# Altium schematic sheet TT1-1-Top.SchDoc: Top
size A3; SheetNumber: 1; SheetTotal: 1
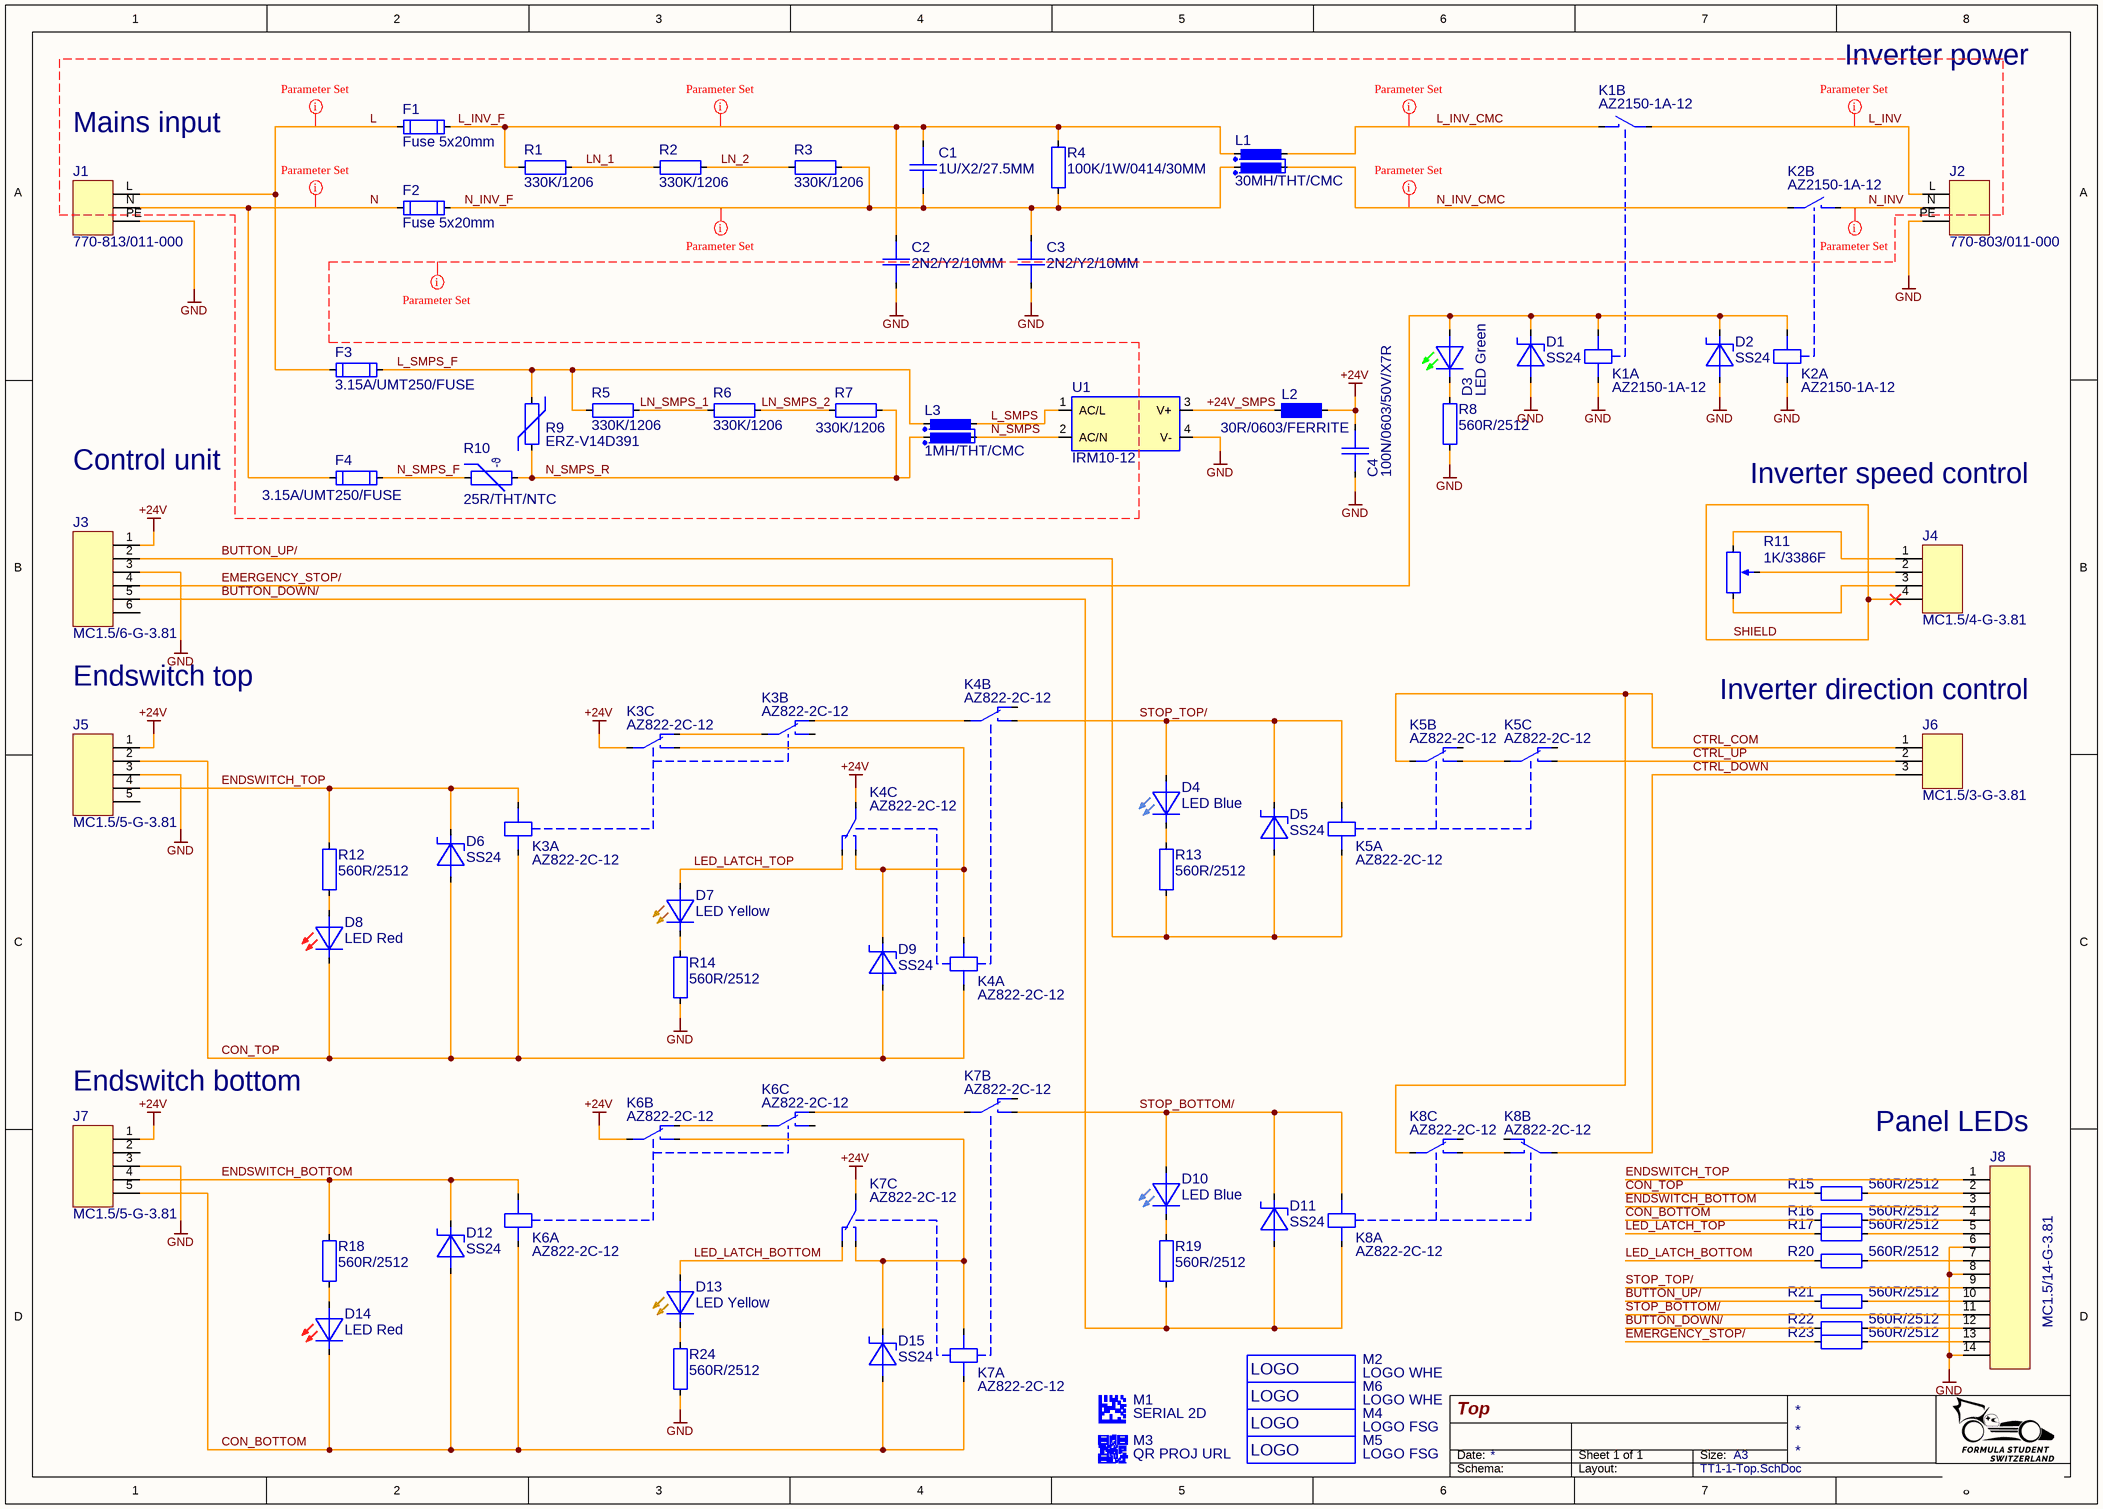
[diagram p0: TT1-1-Top.SchDoc]

## Parts
C1  1U/X2/27.5MM  [CAP2750P315X110X190-BL]
C2  2N2/Y2/10MM  [CAP1000P130X40X90-BL]
C3  2N2/Y2/10MM  [CAP1000P130X40X90-BL]
C4  100N/0603/50V/X7R  [CAP0603_X7R]
D1  SS24  [DIOM5226X230]
D2  SS24  [DIOM5226X230]
D3  LED Green  [LED0603_GREEN]
D4  LED Blue  [LED0603_BLUE]
D5  SS24  [DIOM5226X230]
D6  SS24  [DIOM5226X230]
D7  LED Yellow  [LED0603_YELLOW]
D8  LED Red  [LED0603_RED]
D9  SS24  [DIOM5226X230]
D10  LED Blue  [LED0603_BLUE]
D11  SS24  [DIOM5226X230]
D12  SS24  [DIOM5226X230]
D13  LED Yellow  [LED0603_YELLOW]
D14  LED Red  [LED0603_RED]
D15  SS24  [DIOM5226X230]
F1  Fuse 5x20mm  [OGN_THR]
F2  Fuse 5x20mm  [OGN_THR]
F3  3.15A/UMT250/FUSE  [UMT250]
F4  3.15A/UMT250/FUSE  [UMT250]
J1  770-813/011-000  [770-813/011-000]
J2  770-803/011-000  [770-803/011-000]
J3  MC1.5/6-G-3.81  [MC1.5/6-G-3.81]
J4  MC1.5/4-G-3.81  [MC1.5/4-G-3.81]
J5  MC1.5/5-G-3.81  [MC1.5/5-G-3.81]
J6  MC1.5/3-G-3.81  [MC1.5/3-G-3.81]
J7  MC1.5/5-G-3.81  [MC1.5/5-G-3.81]
J8  MC1.5/14-G-3.81  [MC1.5/14-G-3.81]
K1  AZ2150-1A-12  [AZ2150-SPST-NO]  (parts A,B of 2)
K2  AZ2150-1A-12  [AZ2150-SPST-NO]  (parts A,B of 2)
K3  AZ822-2C-12  [AZ822]  (parts A,B,C of 3)
K4  AZ822-2C-12  [AZ822]  (parts A,B,C of 3)
K5  AZ822-2C-12  [AZ822]  (parts A,B,C of 3)
K6  AZ822-2C-12  [AZ822]  (parts A,B,C of 3)
K7  AZ822-2C-12  [AZ822]  (parts A,B,C of 3)
K8  AZ822-2C-12  [AZ822]  (parts A,B,C of 3)
L1  30MH/THT/CMC  [CMC-WE-CMBNC-XL-7448050530]
L2  30R/0603/FERRITE  [FB0603]
L3  1MH/THT/CMC  [DFKH-CASE-50-2]
M1  SERIAL 2D  [SERIAL-2D-8MM-RESTRICT]  (no BOM)
M2  LOGO WHE  [LOGO-WHE-10MM]  (no BOM)
M3  QR PROJ URL  [QR-PROJECT-URL-10MM]  (no BOM)
M4  LOGO FSG  [LOGO-FSG-15MM]  (no BOM)
M5  LOGO FSG  [LOGO-FSG-20MM]  (no BOM)
M6  LOGO WHE  [LOGO-WHE-20MM]
R1  330K/1206  [R1206-0.80-WW]
R2  330K/1206  [R1206-0.80-WW]
R3  330K/1206  [R1206-0.80-WW]
R4  100K/1W/0414/30MM  [RESAD3000W80L1200D400B]
R5  330K/1206  [R1206-0.80-WW]
R6  330K/1206  [R1206-0.80-WW]
R7  330K/1206  [R1206-0.80-WW]
R8  560R/2512  [R2512-0.65-WW]
R9  ERZ-V14D391  [RESD750W80D155]
R10  25R/THT/NTC  [RESD500W60D115]
R11  1K/3386F  [3386F]
R12  560R/2512  [R2512-0.65-WW]
R13  560R/2512  [R2512-0.65-WW]
R14  560R/2512  [R2512-0.65-WW]
R15  560R/2512  [R2512-0.65-WW]
R16  560R/2512  [R2512-0.65-WW]
R17  560R/2512  [R2512-0.65-WW]
R18  560R/2512  [R2512-0.65-WW]
R19  560R/2512  [R2512-0.65-WW]
R20  560R/2512  [R2512-0.65-WW]
R21  560R/2512  [R2512-0.65-WW]
R22  560R/2512  [R2512-0.65-WW]
R23  560R/2512  [R2512-0.65-WW]
R24  560R/2512  [R2512-0.65-WW]
U1  IRM10-12  [IRM10]

## Nets
+24V: C4.1 J3.1 J5.1 J7.1 K3.6(COM2) K4.6(COM2) K6.3(COM1) K7.6(COM2) L2.2
GND: C2.2 C3.2 C4.2 D1.2 D2.2 J1.PE J2.PE J3.3 J5.3 J7.3 J8.6 J8.8 J8.14 K1.2 K2.2 R8.2 R14.2 R24.2 U1.4(V-)
+24V_SMPS: L2.1 U1.3(V+)
BUTTON_DOWN/: D11.2 J3.5 K8.2 R19.2 R22.1
BUTTON_UP/: D5.2 J3.2 K5.1 R13.2 R21.1
CON_BOTTOM: D12.2 D14.1 D15.2 J7.5 K6.2 K7.2 R16.1
CON_TOP: D6.2 D8.1 D9.2 J5.2 K3.2 K4.2 R15.1
CTRL_COM: J6.1 K5.3(COM1) K8.6(COM2)
CTRL_DOWN: J6.3 K8.3(COM1)
CTRL_UP: J6.2 K5.8(NO2)
EMERGENCY_STOP/: D1.1 D2.1 D3.2 J3.4 K1.1 K2.1 R23.1
ENDSWITCH_BOTTOM: D12.1 J7.4 J8.3 K6.1 R18.1
ENDSWITCH_TOP: D6.1 J5.4 J8.1 K3.1 R12.1
L: F1.1 F3.1 J1.L
L_INV: J2.L K1.3(COM1)
L_INV_CMC: K1.4(NO1) L1.3
L_INV_F: C1.1 C2.1 F1.2 L1.1 R1.1 R4.1
L_SMPS: L3.3 U1.1(AC/L)
L_SMPS_F: F3.2 L3.1 R5.1 R9.1
LED_LATCH_BOTTOM: D13.2 K7.7(NC2) R20.1
LED_LATCH_TOP: D7.2 K4.7(NC2) R17.1
LN_1: R1.2 R2.1
LN_2: R2.2 R3.1
LN_SMPS_1: R5.2 R6.2
LN_SMPS_2: R6.1 R7.1
N: F2.1 F4.1 J1.N
N_INV: J2.N K2.4(NO1)
N_INV_CMC: K2.3(COM1) L1.4
N_INV_F: C1.2 C3.1 F2.2 L1.2 R3.2 R4.2
N_SMPS: L3.4 U1.2(AC/N)
N_SMPS_F: F4.2 R10.1
N_SMPS_R: L3.2 R7.2 R9.2 R10.2
SHIELD: J4.4
STOP_BOTTOM/: D10.2 D11.1 J8.11 K7.5(NO1) K8.1
STOP_TOP/: D4.2 D5.1 J8.9 K4.5(NO1) K5.2
NetD3_1: D3.1 R8.1
NetD4_1: D4.1 R13.1
NetD7_1: D7.1 R14.1
NetD8_2: D8.2 R12.2
NetD9_1: D9.1 K3.8(NO2) K4.1 K4.8(NO2)
NetD10_1: D10.1 R19.1
NetD13_1: D13.1 R24.1
NetD14_2: D14.2 R18.2
NetD15_1: D15.1 K6.5(NO1) K7.1 K7.8(NO2)
NetJ4_1: J4.1 R11.2
NetJ4_2: J4.2 R11.3
NetJ4_3: J4.3 R11.1
NetJ8_2: J8.2 R15.2
NetJ8_4: J8.4 R16.2
NetJ8_5: J8.5 R17.2
NetJ8_7: J8.7 R20.2
NetJ8_10: J8.10 R21.2
NetJ8_12: J8.12 R22.2
NetJ8_13: J8.13 R23.2
NetK3_3: K3.3(COM1) K3.7(NC2)
NetK3_4: K3.4(NC1) K4.3(COM1)
NetK5_5: K5.5(NO1) K5.6(COM2)
NetK6_4: K6.4(NC1) K6.6(COM2)
NetK6_7: K6.7(NC2) K7.3(COM1)
NetK8_5: K8.5(NO1) K8.8(NO2)

Not connected (* = marked no-connect by the designer): J3 6; J5 5; J7 2; K3 5(NO1); K4 4(NC1); K5 4(NC1) 7(NC2); K6 8(NO2); K7 4(NC1); K8 4(NC1) 7(NC2)

## Layout directives
net class Mains: L, L_INV, L_INV_CMC, L_INV_F, L_SMPS, L_SMPS_F, LN_1, LN_2, LN_SMPS_1, LN_SMPS_2, N, N_INV, N_INV_CMC, N_INV_F, N_SMPS, N_SMPS_F, N_SMPS_R
net class L: L, L_INV, L_INV_CMC, L_INV_F
net class N: N, N_INV, N_INV_CMC, N_INV_F

## Notes on the sheet
- Inverter power
- Mains input
- Control unit
- Inverter speed control
- Endswitch top
- (near J6) Inverter direction control
- (near J7) Endswitch bottom
- Panel LEDs
- Date:
- Size:
- A3
- Schema:
- Layout:
- (in symbol 25R/THT/NTC) -ϑ

## Library data of the parts
C1 = 1U/X2/27.5MM: CAP THT 31.5X11X19 1uF 305V X2; Manufacturer: GENERIC; Manufacturer 1: EPCOS - TDK Electronics; Manufacturer Part Number 1: B32924C3105K000; Absolute Value: 1E-6; Part Number: 1U/X2/27.5MM; Value: 1UF; HelpURL: https://product.tdk.com/en/system/files?file=dam/doc/product/capacitor/film/emi/data_sheet/20/20/db/fc_2009/x2_b32921_928.pdf; Supplier 1: Digi-Key; Supplier Part Number 1: 495-4209-ND
C2 C3 = 2N2/Y2/10MM: CAP THT 13X4X9 2.2nF 300V Y2; Manufacturer: GENERIC; Manufacturer 1: EPCOS - TDK Electronics; Manufacturer Part Number 1: B32021A3222K000; Absolute Value: 2.2E-9; Part Number: 2N2/Y2/10MM; Value: 2.2nF; HelpURL: https://www.tdk-electronics.tdk.com/inf/20/20/db/fc_2009/Y2_B32021_026.pdf; Supplier 1: Digi-Key; Supplier Part Number 1: 495-4788-ND
C4 = 100N/0603/50V/X7R: CAP SM 0603 100nF 50V X7R; Manufacturer: GENERIC; Manufacturer 1: YAGEO; Manufacturer Part Number 1: CC0603KPX7R9BB104; Absolute Value: 1E-7; Eurocircuits GPN: GPC0603104; Part Number: 100N/0603/50V/X7R; Package: 0603; Value: 100nF; HelpURL: https://www.yageo.com/upload/media/product/app/datasheet/mlcc/upy-gphc_x7r_6_3v-to-250v.pdf; Supplier 1: Digi-Key; Supplier Part Number 1: 311-3567-1-ND; Manufacturer 2: YAGEO; Manufacturer Part Number 2: CC0603MRX7R9BB104; Supplier 2: Digi-Key; Supplier Part Number 2: 311-4110-1-ND; Supplier 3: LCSC; Supplier Part Number 3: C14663; JLC Type: Basic
D1 D2 D5 D6 D9 D11 D12 D15 = SS24: Si Shottky Diode 2A DO-214AC; Manufacturer: MSKSEMI; Manufacturer 1: Taiwan Semiconductor Corporation; Absolute Value: 40V; Part Number: SS24; Package: DO-214AC, SMA; Value: SS24; HelpURL: https://datasheet.lcsc.com/lcsc/2202131930_MSKSEMI-SS24-MS_C2836395.pdf; Manufacturer Part Number 1: SS24; Supplier 1: Digikey; Supplier Part Number 1: 1801-SS24CT-ND; Manufacturer 3: MSKSEMI; Manufacturer Part Number 3: SS24-MS; Supplier 3: LCSC; Supplier Part Number 3: C2836395; JLC Type: Extended; Manufacturer 2: ElecSuper; Manufacturer Part Number 2: SS24; Supplier 2: LCSC; Supplier Part Number 2: C7509566
D3 = LED Green 0603: Generic LED Green 0603; Manufacturer 1: Würth; Manufacturer Part Number 1: 150060VS75000; Part Number: LED Green 0603; Manufacturer: GENERIC; Package: 603; Value: Green; Absolute Value: Green; HelpURL: https://www.we-online.com/katalog/datasheet/150060VS75000.pdf; Supplier 1: Digikey; Supplier Part Number 1: 732-4980-1-ND; Manufacturer 3: Everlight Elec; Manufacturer Part Number 3: 19-217/GHC-YR1S2/3T; Supplier 3: LCSC; Supplier Part Number 3: C72043; JLC Type: Basic
D4 D10 = LED Blue 0603: Generic LED Blue 0603; Manufacturer 1: Würth; Manufacturer Part Number 1: 150060BS75000; Part Number: LED Blue 0603; Manufacturer: GENERIC; Package: 603; Value: Blue; Absolute Value: Blue; HelpURL: https://www.we-online.com/katalog/datasheet/150060BS75000.pdf; Supplier 1: Digikey; Supplier Part Number 1: 732-4966-1-ND; Manufacturer 3: Everlight Elec; Manufacturer Part Number 3: 19-217/BHC-ZL1M2RY/3T; Supplier 3: LCSC; Supplier Part Number 3: C72041; JLC Type: Basic
D7 D13 = LED Yellow 0603: Generic LED Yellow 0603; Manufacturer 1: Würth; Manufacturer Part Number 1: 150060YS75000; Part Number: LED Yellow 0603; Manufacturer: GENERIC; Package: 603; Value: Yellow; Absolute Value: Yellow; HelpURL: https://www.we-online.com/components/products/datasheet/150060YS75000.pdf; Supplier 1: Digikey; Supplier Part Number 1: 732-4981-1-ND; Manufacturer 3: Everlight Elec; Manufacturer Part Number 3: 19-213/Y2C-CQ2R2L/3T(CY); Supplier 3: LCSC; Supplier Part Number 3: C72038; JLC Type: Basic
D8 D14 = LED Red 0603: Generic LED Red 0603; Manufacturer 1: Würth; Manufacturer Part Number 1: 150060RS75000; Part Number: LED Red 0603; Manufacturer: GENERIC; Package: 603; Value: Red; Absolute Value: Red; HelpURL: https://www.we-online.com/katalog/datasheet/150060RS75000.pdf; Supplier 1: Digikey; Supplier Part Number 1: 732-4978-1-ND; Manufacturer 3: Hubei KENTO Elec; Manufacturer Part Number 3: KT-0603R; Supplier 3: LCSC; Supplier Part Number 3: C2286; JLC Type: Basic
F1 F2 = Fuse/5x20mm/OGN: open fuse holder, 5 x 20 mm, THR, IEC 60335-1; Manufacturer: Schurter; Manufacturer Part Number 1: 3-132-873; Part Number: Fuse/5x20mm/OGN; Package: 5X20; HelpURL: https://www.schurter.com/en/datasheet/typ_OGN.pdf; Manufacturer 1: Schurter; Supplier 1: Digi-Key; Supplier Part Number 1: 486-3-132-873-ND
F3 F4 = 3.15A/UMT250/FUSE: Fuse 250VAC 3.15A UMT250; Manufacturer: Schurter; Manufacturer Part Number 1: 3403.0171.24; Absolute Value: 3.15; Part Number: 3.15A/UMT250/FUSE; Package: UMT250; HelpURL: https://www.schurter.com/en/datasheet/typ_UMT_250.pdf; Manufacturer 1: Schurter; Supplier 1: Digi-Key; Supplier Part Number 1: 486-3482-1-ND; Value: 3.15A
J1 = 770-813/011-000: Wago 770-813/011-000; Manufacturer 1: WAGO Corporation; Part Number: 770-813/011-000; Manufacturer: Wago; HelpURL: https://www.wago.com/global/pluggable-connectors/plug-for-pcbs/p/770-813_011-000; Manufacturer Part Number 1: 770-813/011-000; Supplier 1: Digi-Key; Supplier Part Number 1: 2946-770-813/011-000-ND
J2 = 770-803/011-000: Wago 770-803/011-000; Manufacturer 1: WAGO Corporation; Part Number: 770-803/011-000; Manufacturer: Wago; HelpURL: https://www.wago.com/global/pluggable-connectors/socket-for-pcbs/p/770-803_011-000; Manufacturer Part Number 1: 770-803/011-000; Supplier 1: Digi-Key; Supplier Part Number 1: 2946-770-803/011-000-ND
J3 = MC1.5/6-G-3.81: Phoenix contact MC 1,5/ 6-G-3,81; Manufacturer Part Number 1: 1803316; Part Number: MC1.5/6-G-3.81; Manufacturer: Phoenix; HelpURL: https://www.phoenixcontact.com/en-us/products/pcb-header-mc-15-6-g-381-1803316?type=pdf; Manufacturer 1: Phoenix; Supplier 1: Digi-Key; Supplier Part Number 1: 277-1210-ND
J4 = MC1.5/4-G-3.81: Phoenix contact MC 1,5/ 4-G-3,81; Manufacturer Part Number 1: 1803293; Part Number: MC1.5/4-G-3.81; Manufacturer: Phoenix; HelpURL: https://www.phoenixcontact.com/en-us/products/pcb-header-mc-15-4-g-381-1803293?type=pdf; Manufacturer 1: Phoenix; Supplier 1: Digi-Key; Supplier Part Number 1: 277-1208-ND
J5 J7 = MC1.5/5-G-3.81: Phoenix contact MC 1,5/ 5-G-3,81; Manufacturer Part Number 1: 1803303; Part Number: MC1.5/5-G-3.81; Manufacturer: Phoenix; HelpURL: https://www.phoenixcontact.com/en-us/products/pcb-header-mc-15-5-g-381-1803303?type=pdf; Manufacturer 1: Phoenix; Supplier 1: Digi-Key; Supplier Part Number 1: 277-1209-ND
J6 = MC1.5/3-G-3.81: Phoenix contact MC 1,5/ 3-G-3,81; Manufacturer Part Number 1: 1803280; Part Number: MC1.5/3-G-3.81; Manufacturer: Phoenix; HelpURL: https://www.phoenixcontact.com/en-us/products/pcb-header-mc-15-3-g-381-1803280?type=pdf; Manufacturer 1: Phoenix; Supplier 1: Digi-Key; Supplier Part Number 1: 277-1207-ND
J8 = MC1.5/14-G-3.81: Phoenix contact MC 1,5/ 14-G-3,81; Manufacturer Part Number 1: 1803390; Part Number: MC1.5/14-G-3.81; Manufacturer: Phoenix; HelpURL: https://www.phoenixcontact.com/en-us/products/pcb-header-mc-1514-g-381-1803390?type=pdf; Manufacturer 1: Phoenix; Supplier 1: Digi-Key; Supplier Part Number 1: 277-1218-ND
K1 K2 = AZ2150-1A-12: Miniature Power Relay, SPST-NO, 12V Coil, 40A 30VDC 300VAC; Manufacturer: Zettler; Manufacturer 1: American Zettler; Manufacturer Part Number 1: AZ2150-1A-12DEF; Part Number: AZ2150-1A-12; HelpURL: https://www.azettler.com/pdfs/az2150.pdf; Supplier 1: Digi-Key; Supplier Part Number 1: 3385-AZ2150-1A-12DEF-ND
K3-K8 = AZ822-2C-12: Subminiature DIP Relay, DPDT, 12V 98mW Coil, 2A 220VDC 250VAC; Manufacturer: Zettler; Manufacturer 1: American Zettler; Manufacturer Part Number 1: AZ822-2C-12DE; Part Number: AZ822-2C-12; HelpURL: https://www.azettler.com/pdfs/az822.pdf; Supplier 1: Digi-Key; Supplier Part Number 1: 3385-AZ822-2C-12DE-ND
L1 = 30MH/THT/CMC: CMC 30mH 5A Würth CMBNC 7448050530; Manufacturer 1: Würth Elektronik; Absolute Value: 0.03; Part Number: 30MH/THT/CMC; Manufacturer: Würth; Package: CMBNC; Value: 30MH; HelpURL: https://www.we-online.com/components/products/datasheet/7448050530.pdf; Manufacturer Part Number 1: 7448050530; Supplier 1: Digi-Key; Supplier Part Number 1: 732-5596-ND
L2 = 30R/0603/FERRITE: 30R@100MHz 5A 0603 Ferrite; Manufacturer: GENERIC; Manufacturer 1: Laird-Signal Integrity Products; Manufacturer Part Number 1: HI0603R300R-10; Value: 30R; Absolute Value: 1000; Part Number: 30R/0603/FERRITE; Package: 603; HelpURL: https://www.laird.com/document/datasheet/hi0603r300r-10-datasheet; Supplier 1: Digi-Key; Supplier Part Number 1: 240-HI0603R300R-10CT-ND
L3 = 1MH/THT/CMC: CMC 1mH 2A THT Schurter DFKH-14-0003; Manufacturer 1: SCHURTER Inc.; Part Number: 1MH/THT/CMC; Manufacturer: SCHURTER; Package: 15X10.5mm; Value: 1MH; HelpURL: https://www.schurter.com/en/datasheet/typ_DFKH.pdf; Manufacturer Part Number 1: DFKH-14-0003; Supplier 1: Digi-Key; Supplier Part Number 1: 486-3121-ND
M1 = SERIAL 2D 8MM RESTRICT: 2D Serial number placeholder, Dotmatrix or QR, size: 8mm, restriction on top layer; Manufacturer: NONE; Part Number: SERIAL 2D 8MM RESTRICT
M2 = LOGO WHE 10MM: WHE logo, size 10mm; Manufacturer: NONE; Part Number: LOGO WHE 10MM
M3 = QR PROJ URL 10MM: QR Code, Project URL, 10mm; Manufacturer: NONE; Part Number: QR PROJ URL 10MM
M4 = LOGO FSG 15MM: FSG logo, size 15mm; Manufacturer: NONE; Part Number: LOGO FSG 15MM
M5 = LOGO FSG 20MM: FSG logo, size 20mm; Manufacturer: NONE; Part Number: LOGO FSG 20MM
M6 = LOGO WHE 20MM: WHE logo, size 20mm; Manufacturer: NONE; Part Number: LOGO WHE 20MM
R1-R3 R5-R7 = 330K/1206: RES SM 1206 330K; Manufacturer: GENERIC; Manufacturer 1: YAGEO; Manufacturer Part Number 1: RC1206FR-07330KL; Absolute Value: 330000; Part Number: 330K/1206; Package: 1206; Value: 330K; HelpURL: https://www.yageo.com/upload/media/product/products/datasheet/rchip/PYu-RC_Group_51_RoHS_L_12.pdf; Supplier 1: Digi-Key; Supplier Part Number 1: 311-330KFRCT-ND
R4 = 100K/1W/0414/30MM: RES TH 1W 0414 30MM 100K; Manufacturer: GENERIC; Manufacturer 1: Vishay; Manufacturer Part Number 1: MBE04140C1003FC100; Absolute Value: 100000; Part Number: 100K/1W/0414/30MM; Package: 0414; Value: 100K; HelpURL: https://www.vishay.com/docs/28766/mbxsma.pdf; Supplier 1: Distrelec; Supplier Part Number 1: 160-59-946
R8 R12-R24 = 560R/2512: RES SM 2512 560R; Manufacturer: GENERIC; Manufacturer 1: YAGEO; Manufacturer Part Number 1: RC2512FK-07560RL; Absolute Value: 560; Part Number: 560R/2512; Package: 2512; Value: 560R; HelpURL: https://www.yageo.com/upload/media/product/products/datasheet/rchip/PYu-RC_Group_51_RoHS_L_12.pdf; Supplier 1: Digi-Key; Supplier Part Number 1: 13-RC2512FK-07560RLCT-ND; Manufacturer 2: YAGEO; Manufacturer Part Number 2: RC2512JK-07560RL; Supplier 2: Digi-Key; Supplier Part Number 2: 13-RC2512JK-07560RLCT-ND
R9 = ERZ-V14D391: VARISTOR 391V 6kA; Manufacturer: GENERIC; Manufacturer 1: Panasonic Electronic Components; Absolute Value: 391; Part Number: ERZ-V14D391; Package: 7.5mm; Value: 391V; HelpURL: https://industrial.panasonic.com/cdbs/www-data/pdf/AWA0000/AWA0000C1.pdf; Manufacturer Part Number 1: ERZ-V14D391; Supplier 1: Digi-Key; Supplier Part Number 1: P7266-ND
R10 = 25R/THT/NTC: RES NTC THT 5 25R; Manufacturer: GENERIC; Manufacturer 1: EPCOS - TDK Electronics; Manufacturer Part Number 1: B57236S0250M000; Absolute Value: 25; Part Number: 25R/THT/NTC; Package: 5mm; Value: 25R; HelpURL: https://product.tdk.com/system/files/dam/doc/product/protection/current/ntc-limiter/data_sheet/50/db/icl_16/s236.pdf; Supplier 1: Digi-Key; Supplier Part Number 1: 495-3048-ND
R11 = 1K/3386F: RES POT 3386F 1K; Manufacturer: Bourns; Manufacturer 1: Bourns Inc.; Manufacturer Part Number 1: 3386F-1-102TLF; Absolute Value: 1000; Part Number: 1K/3386F; Package: 3386F; Value: 1K; HelpURL: https://www.bourns.com/docs/Product-Datasheets/3386.pdf; Supplier 1: Digi-Key; Supplier Part Number 1: 3386F-1-102TLF-ND
U1 = IRM10-12: 10W AC-DC PCB-Mount Green Power Module, 12V; Manufacturer 1: MEAN WELL USA Inc.; Manufacturer Part Number 1: IRM-10-12; Manufacturer: Meanwell; Part Number: IRM10-12; Package: Module; HelpURL: https://www.meanwell-web.com/content/files/pdfs/productPdfs/MW/IRM-10/IRM-10-spec.pdf; Supplier 1: Digi-Key; Supplier Part Number 1: 1866-3028-ND